# Altium schematic sheet OUTPUT_BUFFER.SchDoc: Output buffer
size 297 x 209 mm; CheckedBy: -; CompanyName: CERN; DrawnBy: GK; Organization: CERN; Address1: European Organization for Nuclear Research; Address2: CH-1211 Geneve 23 - Switzerland; Revision: -; SheetNumber: 9; SheetTotal: 9; EDA_Number: EDA-XXXXX-VX-X; Projet: FMC Delay 1ns 4cha; ModifiedBy: -; CreateDate: XX/XX/XXXX; CheckedDate: -; Title2: Title2; DivGrp: BE-CO; Designer: GK; ModifiedDate: -
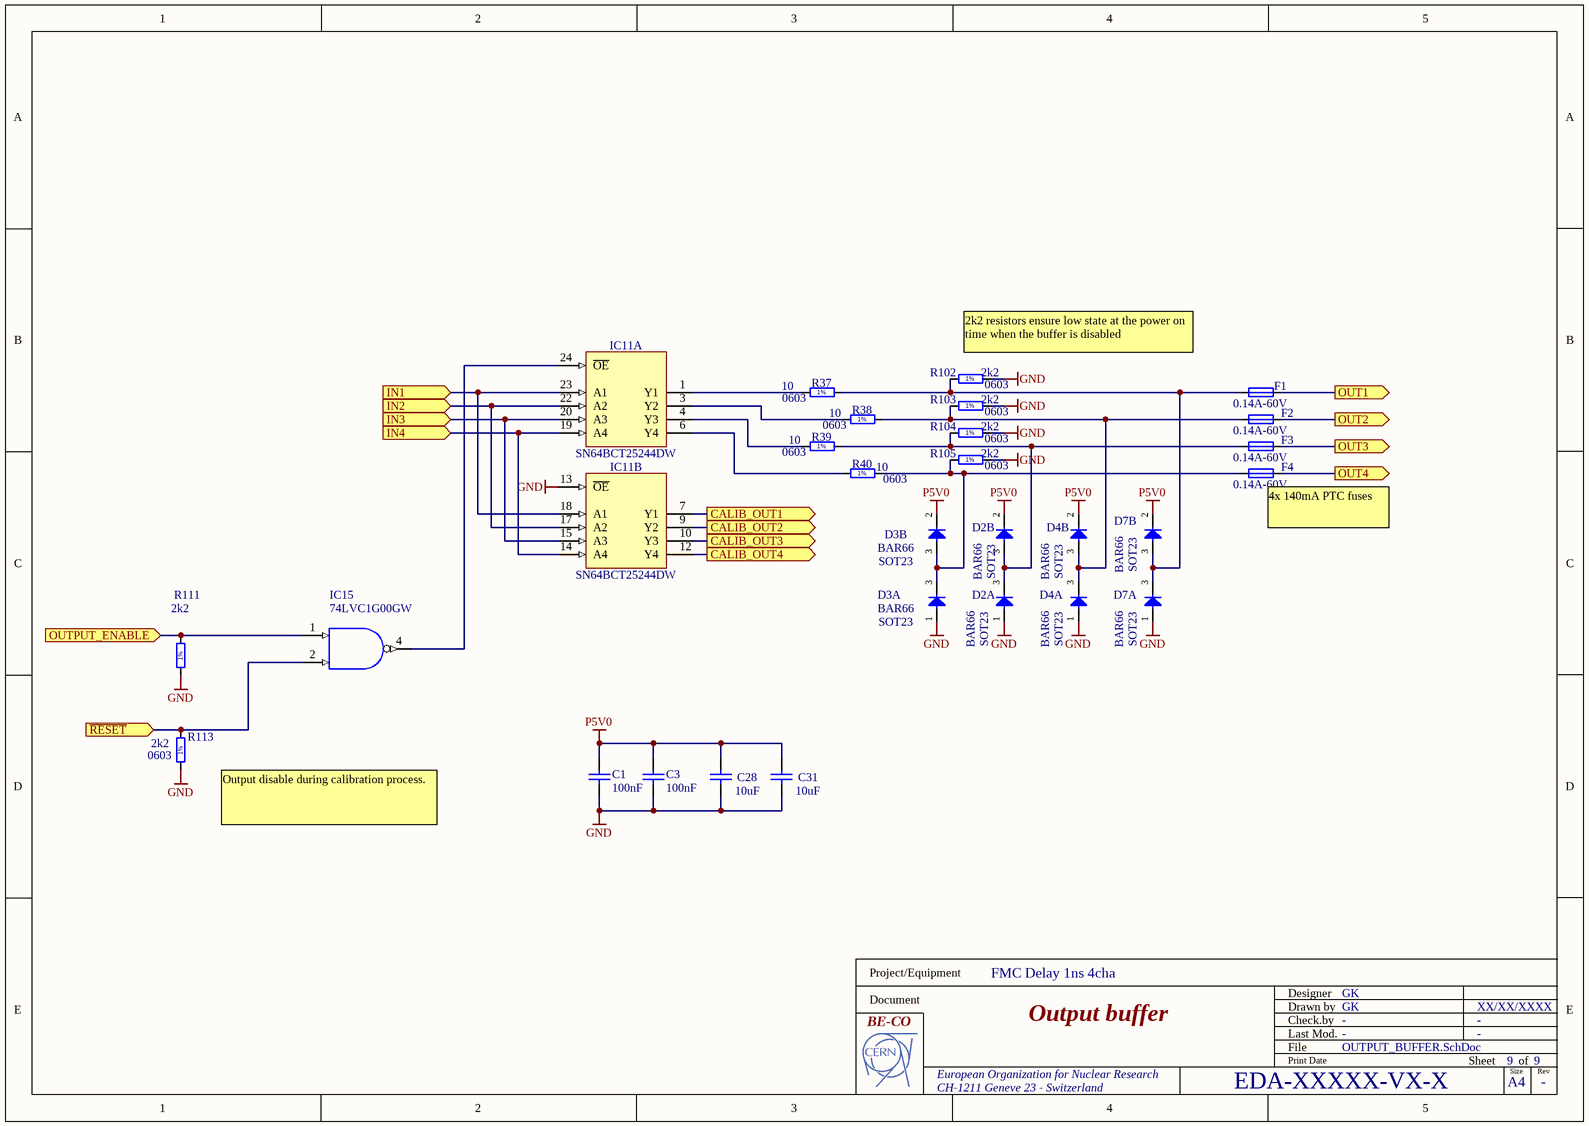
[diagram p0: OUTPUT_BUFFER.SchDoc]

## Parts
C1  100nF  [CAPC1608X87N]
C3  100nF  [CAPC1608X87N]
C28  10uF  [CAPC2012X135N]
C31  10uF  [CAPC2012X135N]
D2  BAR66  Case: SOT23  [SOT95P240X110-3N]  (parts A,B of 2)
D3  BAR66  Case: SOT23  [SOT95P240X110-3N]  (parts A,B of 2)
D4  BAR66  Case: SOT23  [SOT95P240X110-3N]  (parts A,B of 2)
D7  BAR66  Case: SOT23  [SOT95P240X110-3N]  (parts A,B of 2)
F1  0.14A-60V  [FUSRC4632X90N]
F2  0.14A-60V  [FUSRC4632X90N]
F3  0.14A-60V  [FUSRC4632X90N]
F4  0.14A-60V  [FUSRC4632X90N]
IC11  SN64BCT25244DW  [SOIC127P1030X265-24N]  (parts A,B of 2)
IC15  74LVC1G00GW  [SOT65P212X110-5N]
R37  10  Case: 0603  [RESC1608X55N]
R38  10  Case: 0603  [RESC1608X55N]
R39  10  Case: 0603  [RESC1608X55N]
R40  10  Case: 0603  [RESC1608X55N]
R102  2k2  Case: 0603  [RESC1608X55N]
R103  2k2  Case: 0603  [RESC1608X55N]
R104  2k2  Case: 0603  [RESC1608X55N]
R105  2k2  Case: 0603  [RESC1608X55N]
R111  2k2  [RESC1608X55N]
R113  2k2  Case: 0603  [RESC1608X55N]

## Ports
CALIB_OUT1 (out), CALIB_OUT2 (out), CALIB_OUT3 (out), CALIB_OUT4 (out), IN1 (in), IN2 (in), IN3 (in), IN4 (in), OUT1 (out), OUT2 (out), OUT3 (out), OUT4 (out), OUTPUT_ENABLE (in), ~{RESET} (in)

## Nets
GND: C1.2 C3.2 C28.1 C31.1 D2.1(A) D3.1(A) D4.1(A) D7.1(A) IC11.2(GND) IC11.5(GND) IC11.8(GND) IC11.11(GND) IC11.13(~{OE}) IC15.3(GND) R102.2 R103.2 R104.2 R105.2 R111.1 R113.1
P3V3: IC15.5(VCC)
P5V0: C1.1 C3.1 C28.2 C31.2 D2.2(C) D3.2(C) D4.2(C) D7.2(C) IC11.16(VCC) IC11.21(VCC)
~{RESET}: IC15.2(B) R113.2 ; port ~{RESET}
CALIB_OUT1: IC11.7(Y1) ; port CALIB_OUT1
CALIB_OUT2: IC11.9(Y2) ; port CALIB_OUT2
CALIB_OUT3: IC11.10(Y3) ; port CALIB_OUT3
CALIB_OUT4: IC11.12(Y4) ; port CALIB_OUT4
IN1: IC11.18(A1) IC11.23(A1) ; port IN1
IN2: IC11.17(A2) IC11.22(A2) ; port IN2
IN3: IC11.15(A3) IC11.20(A3) ; port IN3
IN4: IC11.14(A4) IC11.19(A4) ; port IN4
OUT1: F1.2 ; port OUT1
OUT2: F2.2 ; port OUT2
OUT3: F3.2 ; port OUT3
OUT4: F4.2 ; port OUT4
OUTPUT_ENABLE: IC15.1(A) R111.2 ; port OUTPUT_ENABLE
NetD2_3: D2.3(COMAC) F3.1 R39.2 R104.1
NetD3_3: D3.3(COMAC) F4.1 R40.2 R105.1
NetD4_3: D4.3(COMAC) F2.1 R38.2 R103.1
NetD7_3: D7.3(COMAC) F1.1 R37.2 R102.1
NetIC11_1: IC11.1(Y1) R37.1
NetIC11_3: IC11.3(Y2) R38.1
NetIC11_4: IC11.4(Y3) R39.1
NetIC11_6: IC11.6(Y4) R40.1
NetIC11_24: IC11.24(~{OE}) IC15.4(Y)

## Notes on the sheet
- (near R102) 2k2 resistors ensure low state at the power on time when the buffer is disabled
- (near F4) 4x 140mA PTC fuses
- (near R113) Output disable during calibration process.
- Project/Equipment
- Document
- Output buffer
- Designer
- Drawn by
- Check.by
- File
- Last Mod.
- Print Date
- Sheet
- Size
- A4
- of
- Rev
- (in symbol R0603_2K2_1%_0.1W_100PPM) 1%
- (in symbol R0603_10R_1%_0.1W_200PPM) 1%

## Library data of the parts
C1 C3 = CC0603_100NF_50V_10%_X7R: Non-polarised capacitor; Manufacturer1 Part Number: 223858615649; Manufacturer: GENERIC; Part Description: SMD Multilayer Chip Ceramic Capacitor; Table: Capacitors SMD; TC: X7R; Tolerance: ±10%; Voltage: 50V; Author: CERN DEM JLC; Case: 0603; Component Type: Standard; CreateDate: 12/3/2007; HelpURL: \\cern.ch\dfs\Applications\Altium\Datasheets\CC0603_X7R_PHYCOMP.pdf; LatestRevisionDate: 12/3/2007; Manufacturer1 ComponentHeight: 0.87mm; Manufacturer1 Example: PHYCOMP; Manufacturer Part Number: CC0603_100NF_50V_10%_X7R; Mounted: Yes; Pin Count: 2; SMD: Yes; Socket: No; Status: Preferred; Value: 100nF; Part Number: CC0603_100NF_50V_10%_X7R; Component Kind: Standard
C28 C31 = CC0805_10UF_16V_10%_X5R: Non-polarised capacitor; Part Description: SMD Multilayer Chip Ceramic Capacitor; Manufacturer: GENERIC; Manufacturer1 Part Number: C0805C106K4PAC; Voltage: 16V; TC: X5R; Tolerance: ±10%; Table: Capacitors SMD; Part Number: CC0805_10UF_16V_10%_X5R; Component Kind: Standard; Component Type: Standard; Pin Count: 2; Value: 10uF; Status: Preferred; Manufacturer Part Number: CC0805_10UF_16V_10%_X5R; Case: 0805; Mounted: Yes; Socket: No; SMD: Yes; Manufacturer1 Example: KEMET; Manufacturer1 ComponentHeight: 1.4mm; HelpURL: \\cern.ch\dfs\Applications\Altium\Datasheets\CC1206_X5R_KEMET.pdf; Author: CERN DEM JLC; CreateDate: 12/3/2007; LatestRevisionDate: 12/3/2007
D2-D4 D7 = BAR66: Serial Diode; Part Description: Silicon PIN Diode Array (Series Connected); Manufacturer: INFINEON; Voltage: 150V; Power: 250mA; Table: Diodes; Part Number: BAR66; Component Kind: Standard; Component Type: Standard; Device: BAR66; PackageDescription: SOT23 3-Leads, Pitch 0.95mm - Body 1.3x2.9mm, IPC Medium Density; Manufacturer Part Number: BAR66; Pin Count: 3; Mounted: Yes; Socket: No; SMD: Yes; ComponentHeight: 1.1mm; HelpURL: \\cern.ch\dfs\Applications\Altium\Datasheets\BAR66.pdf; Author: CERN DEM JLC; CreateDate: 1/18/2010; LatestRevisionDate: 10/5/2010
F1-F4 = FUSR1812_TYCO-miniSMD0114F: Fuse; Part Description: PolySwitch® PTC Overcurrent Protection Device; Manufacturer: TYCO ELECTRONICS; Manufacturer Part Number: miniSMDC014F; Table: Fuses; Part Number: FUSR1812_TYCO-miniSMD0114F; Component Kind: Standard; Component Type: Standard; Pin Count: 2; PackageDescription: Chip Resettable Fuse, 2-Leads, Body 4.6x3.2mm, IPC Medium Density; Family: Fuses Resettable; Mounted: Yes; Socket: No; SMD: Yes; Value: 0.14A-60V; ComponentHeight: 0.89mm; HelpURL: \\cern.ch\dfs\Applications\Altium\Datasheets\FUSR_TYCO_MiniSMD0114F.pdf; Author: CERN DEM JLC; CreateDate: 7/2/2008; LatestRevisionDate: 3/17/2010
IC11 = SN64BCT25244DW: 25-Ohm Octal Buffer/Driver with 3-State Outputs; Part Description: 25-Ohms Octal Buffer/Driver with 3-State Outputs; Manufacturer: TEXAS INSTRUMENTS; Table: Standard Logic; Part Number: SN64BCT25244DW; Component Kind: Standard; Component Type: Standard; Device: SN64BCT25244DW; PackageDescription: SOIC 24, Pitch 1.27mm - Body 7.6x15.6mm, IPC Medium Density; Manufacturer Part Number: SN64BCT25244DW; Pin Count: 24; Case: SOIC24; Mounted: Yes; Socket: No; SMD: Yes; ComponentHeight: 2.65mm; Author: CERN DEM JLC; HelpURL: \\cern.ch\dfs\Applications\Altium\Datasheets\SN64BCT25244DW.pdf; CreateDate: 3/30/2009; LatestRevisionDate: 4/27/2010
IC15 = 74LVC1G00GW: Single 2-Input NAND Gate; Manufacturer: NXP SEMICONDUCTORS; Table: Standard Logic; Part Number: 74LVC1G00GW; Component Kind: Standard; Component Type: Standard; Device: 74LVC1G00GW; PackageDescription: SOT353, SOT, 0.65mm Pitch, 5 pin, 1.25mm W X 2.05mm L X 1.10mm H, IPC Medium Density; Part Description: Single 2-Input NAND Gate; Manufacturer Part Number: 74LVC1G00GW; Pin Count: 3; Case: SOT353; Mounted: Yes; Socket: No; SMD: Yes; ComponentHeight: 1.1mm; Author: CERN DEM JLC; HelpURL: \\cern.ch\dfs\Applications\Altium\Datasheets\74LVC1G00GW.pdf; CreateDate: 1/13/2009; LatestRevisionDate: 3/3/2010
R37-R40 = R0603_10R_1%_0.1W_200PPM: Resistor - 1%; Part Description: General Purpose Thick Film Chip Resistor; Manufacturer: GENERIC; Manufacturer1 Part Number: NRC06F10R0TRF; Power: 0.1W; TC: ±200ppm/°C; Table: Resistors SMD; Part Number: R0603_10R_1%_0.1W_200PPM; Component Kind: Standard; Component Type: Standard; Pin Count: 2; Value: 10; Status: Preferred; Tolerance: ±1%; Manufacturer Part Number: R0603_10R_1%_0.1W_200PPM; Mounted: Yes; Socket: No; SMD: Yes; Manufacturer1 Example: NIC COMPONENT; Manufacturer1 ComponentHeight: 0.55mm; HelpURL: \\cern.ch\dfs\Applications\Altium\Datasheets\R0603_NIC_NRC.pdf; Author: CERN DEM JLC; CreateDate: 12/3/2007; LatestRevisionDate: 6/24/2009
R102-R105 R111 R113 = R0603_2K2_1%_0.1W_100PPM: Resistor - 1%; Part Description: General Purpose Thick Film Chip Resistor; Manufacturer: GENERIC; Manufacturer1 Part Number: NRC06F2201TRF; Power: 0.1W; TC: ±100ppm/°C; Table: Resistors SMD; Part Number: R0603_2K2_1%_0.1W_100PPM; Component Kind: Standard; Component Type: Standard; Pin Count: 2; Value: 2k2; Status: Preferred; Tolerance: ±1%; Manufacturer Part Number: R0603_2K2_1%_0.1W_100PPM; Mounted: Yes; Socket: No; SMD: Yes; Manufacturer1 Example: NIC COMPONENT; Manufacturer1 ComponentHeight: 0.55mm; HelpURL: \\cern.ch\dfs\Applications\Altium\Datasheets\R0603_NIC_NRC.pdf; Author: CERN DEM JLC; CreateDate: 12/3/2007; LatestRevisionDate: 3/13/2008
  R111: Case: 0603